# Altium schematic sheet Sheet1.SchDoc
size A4
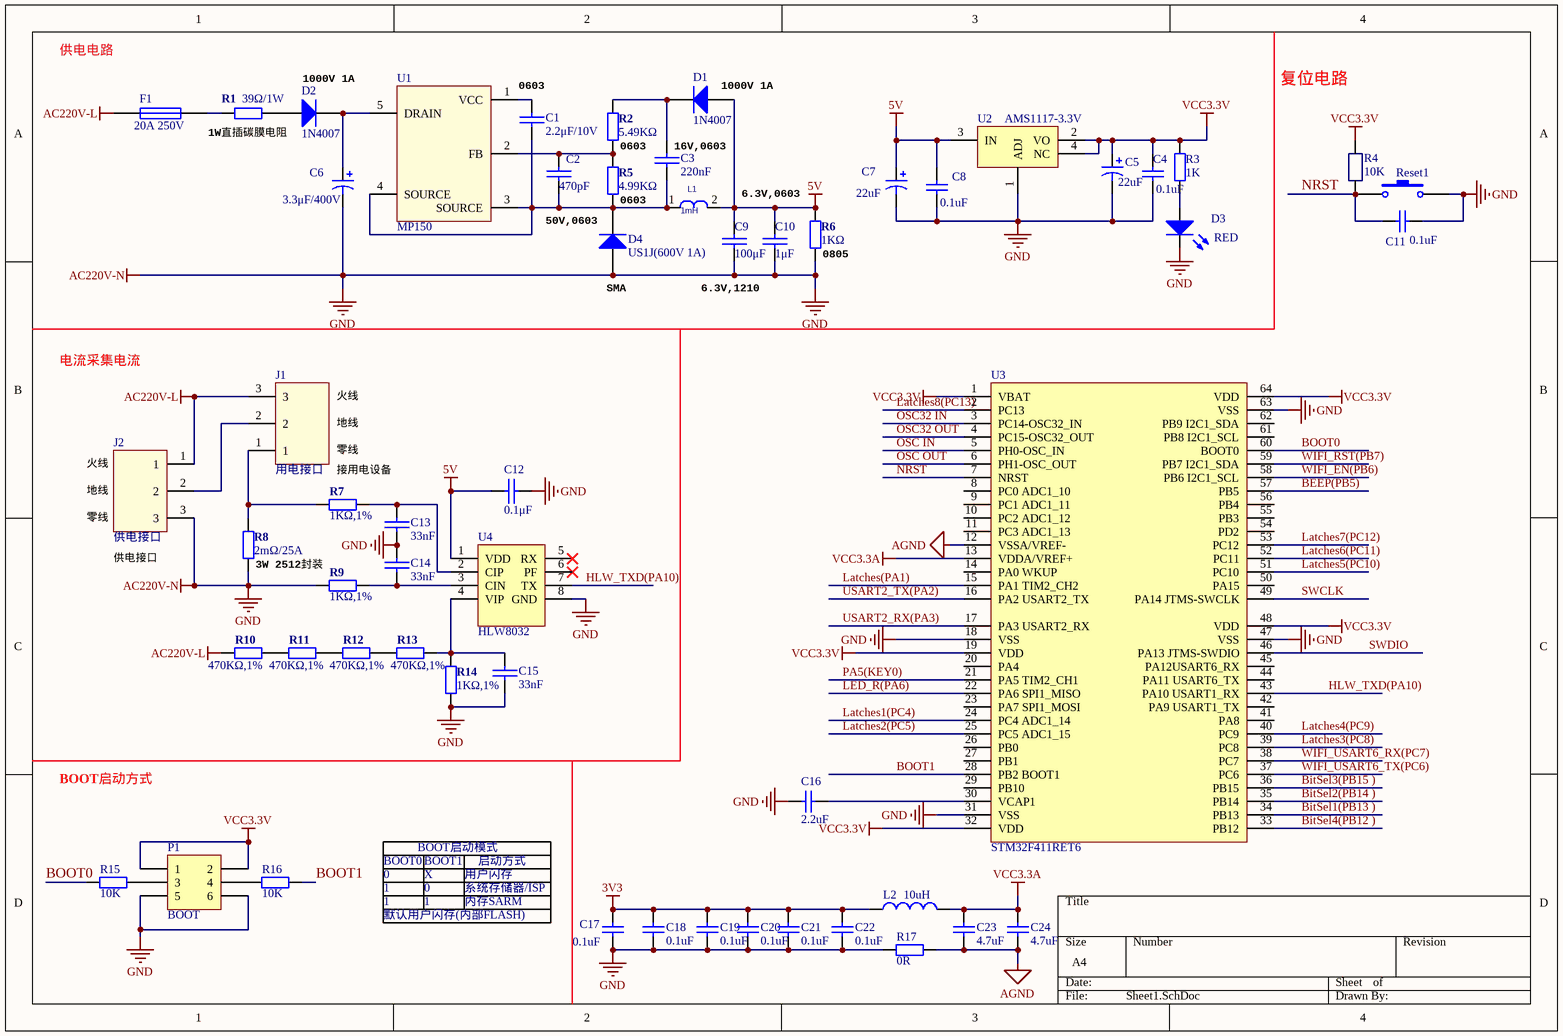
[diagram p0: Sheet1.SchDoc]

## Parts
C1  2.2μF/10V  [LC-0603_C(2.2UF/10V)]
C2  470pF  [LC-0603_C(普通电容)]
C3  220nF  [LC-0603_C(普通电容)]
C4  0.1uF  [LC-0603_C(普通电容)]
C5  22uF  [钽电容0603（25v）]
C6  3.3μF/400V  [直插电解电容 - duplicate]
C7  22uF  [钽电容0603（25v）]
C8  0.1uF  [LC-0603_C(普通电容)]
C9  100μF  [LC-1210_C大电容]
C10  1μF  [LC-0603_C(普通电容)]
C11  0.1uF  [LC-0603_C(普通电容)]
C12  0.1μF  [LC-0603_C(普通电容)]
C13  33nF  [LC-0805_C]
C14  33nF  [LC-0805_C]
C15  33nF  [LC-0805_C]
C16  2.2uF  [LC-0603_C(普通电容)]
C17  0.1uF  [LC-0603_C(普通电容)]
C18  0.1uF  [LC-0603_C(普通电容)]
C19  0.1uF  [LC-0603_C(普通电容)]
C20  0.1uF  [LC-0603_C(普通电容)]
C21  0.1uF  [LC-0603_C(普通电容)]
C22  0.1uF  [LC-0603_C(普通电容)]
C23  4.7uF  [LC-0603_C(普通电容)]
C24  4.7uF  [LC-0603_C(普通电容)]
D1  1N4007  [1N4007]
D2  1N4007  [1N4007]
D3  RED  [LED0603]
D4  US1J(600V 1A)  [US1J二极管LC-SMA(DO-214AC)_S1]
F1  20A 250V  [FUSE_BASE]
J1  用电接口  [3.81-3P(接线端子)输出]
J2  供电接口  [3.81-3P(接线端子)输入]
L1  1mH  [L-10X14(电感)]
L2  10uH  [电感(L0603)]
P1  BOOT  [Header2*3 2.54mm]
R1  39Ω/1W  [炭膜电阻]
R2  5.49KΩ  [LC-0603_R(电阻)]
R3  value 1K  [LC-0603_R(电阻)]  (hidden comment: 10k)
R4  10K  [LC-0603_R(电阻)]
R5  4.99KΩ  [LC-0603_R(电阻)]
R6  1KΩ  [LC-0805_R]
R7  1KΩ,1%  [LC-0805_R]
R8  2mΩ/25A  [R2512猛铜电阻]
R9  1KΩ,1%  [LC-0805_R]
R10  470KΩ,1%  [LC-0805_R]
R11  470KΩ,1%  [LC-0805_R]
R12  470KΩ,1%  [LC-0805_R]
R13  470KΩ,1%  [LC-0805_R]
R14  1KΩ,1%  [LC-0805_R]
R15  10k  [LC-0603_R(电阻)]
R16  10k  [LC-0603_R(电阻)]
R17  value 0R  [LC-0603_R(电阻)]  (hidden comment: 10k)
Reset1  SW-PB  [key]  (value not drawn)
U1  MP150  [MP150(LC-SOT-23-5)]
U2  AMS1117-3.3V  [SOT-223(ASM117-3.3)]
U3  STM32F411RET6  [MCU-LQFP64]
U4  HLW8032  [(HLW8032)LC-SOP-8_150mil]

## Nets
3V3: C17.2 C18.2 C19.2 C20.1 C21.1 C22.1 L2.1
5V: C7.1 C8.2 C9.2 C10.2 C12.1 D1.1(A) L1.2 R6.2 U2.3(IN) U4.1(VDD)
AC220V-L: F1.2 J1.3 J2.1 R10.2
AC220V-N: C4.1 C5.2 C6.2 C7.2 C8.1 C9.1 C10.1 C11.1 C12.2 C13.2 C14.1 C15.2 C16.1 C17.1 C18.1 C19.1 C20.2 C21.2 C22.2 D3.2(K) D4.1(A) J2.3 P1.5 P1.6 R6.1 R8.2 R9.2 R14.2 R17.2 Reset1.2 U2.1(ADJ) U3.18(VSS) U3.31(VSS) U3.47(VSS) U3.63(VSS) U4.8(GND)  [also labelled GND]
AGND: C23.1 C24.1 R17.1 U3.12(VSSA/VREF-)
VCC3.3A: C23.2 C24.2 L2.2 U3.13(VDDA/VREF+)
VCC3.3V: C4.2 C5.1 P1.1 P1.2 R3.1 R4.2 U2.2(VO) U2.4(NC) U3.1(VBAT) U3.19(VDD) U3.32(VDD) U3.48(VDD) U3.64(VDD)
BEEP(PB5): U3.57(PB5)
BitSel1(PB13 ): U3.34(PB13)
BitSel2(PB14 ): U3.35(PB14)
BitSel3(PB15 ): U3.36(PB15)
BitSel4(PB12 ): U3.33(PB12)
BOOT0: R15.2 U3.60(BOOT0)
BOOT1: R16.1 U3.28(PB2_BOOT1)
HLW_TXD(PA10): U3.43(PA10_USART1_RX) U4.7(TX)
Latches1(PC4): U3.24(PC4_ADC1_14)
Latches2(PC5): U3.25(PC5_ADC1_15)
Latches3(PC8): U3.39(PC8)
Latches4(PC9): U3.40(PC9)
Latches5(PC10): U3.51(PC10)
Latches6(PC11): U3.52(PC11)
Latches7(PC12): U3.53(PC12)
Latches8(PC13): U3.2(PC13)
Latches(PA1): U3.15(PA1_TIM2_CH2)
LED_R(PA6): U3.22(PA6_SPI1_MISO)
NRST: C11.2 R4.1 Reset1.1 U3.7(NRST)
OSC32 IN: U3.3(PC14-OSC32_IN)
OSC32 OUT: U3.4(PC15-OSC32_OUT)
OSC IN: U3.5(PH0-OSC_IN)
OSC OUT: U3.6(PH1-OSC_OUT)
PA5(KEY0): U3.21(PA5_TIM2_CH1)
SWCLK: U3.49(PA14_JTMS-SWCLK)
SWDIO: U3.46(PA13_JTMS-SWDIO)
USART2_RX(PA3): U3.17(PA3_USART2_RX)
USART2_TX(PA2): U3.16(PA2_USART2_TX)
WIFI_EN(PB6): U3.58(PB6_I2C1_SCL)
WIFI_RST(PB7): U3.59(PB7_I2C1_SDA)
WIFI_USART6_RX(PC7): U3.38(PC7)
WIFI_USART6_TX(PC6): U3.37(PC6)
NetC1_1: C1.1 C2.1 C3.1 D4.2(K) L1.1 R5.1 U1.3(SOURCE) U1.4(SOURCE)
NetC1_2: C1.2 U1.1(VCC)
NetC2_2: C2.2 R2.1 R5.2 U1.2(FB)
NetC3_2: C3.2 D1.2(K) R2.2
NetC6_1: C6.1 D2.2(K) U1.5(DRAIN)
NetC13_1: C13.1 R7.1 U4.2(CIP)
NetC14_2: C14.2 R9.1 U4.3(CIN)
NetC15_1: C15.1 R13.1 R14.1 U4.4(VIP)
NetC16_2: C16.2 U3.30(VCAP1)
NetD2_1: D2.1(A) R1.2
NetD3_1: D3.1(A) R3.2
NetF1_1: F1.1 R1.1
NetJ1_1: J1.1 R7.2 R8.1
NetJ1_2: J1.2 J2.2
NetP1_3: P1.3 R15.1
NetP1_4: P1.4 R16.2
NetR10_1: R10.1 R11.2
NetR11_1: R11.1 R12.2
NetR12_1: R12.1 R13.2

Not connected (* = marked no-connect by the designer): U3 8(PC0_ADC1_10) 9(PC1_ADC1_11) 10(PC2_ADC1_12) 11(PC3_ADC1_13) 14(PA0_WKUP) 20(PA4) 23(PA7_SPI1_MOSI) 26(PB0) 27(PB1) 29(PB10) 41(PA8) 42(PA9_USART1_TX) 44(PA11_USART6_TX) 45(PA12USART6_RX) 50(PA15) 54(PD2) 55(PB3) 56(PB4) 61(PB8_I2C1_SCL) 62(PB9_I2C1_SDA); U4 5(RX)* 6(PF)*

## Notes on the sheet
- 供电电路
- (near D2) 1000V 1A
- 0603
- (near D1) 1000V 1A
- 复位电路
- (near R1) 1W直插碳膜电阻
- (near R2) 0603
- (near C3) 16V,0603
- 50V,0603
- (near R5) 0603
- 6.3V,0603
- (near D4) SMA
- 6.3V,1210
- (near R6) 0805
- 电流采集电流
- 火线
- 地线
- 零线
- (near R7) 接用电设备
- (near J2) 供电接口
- (near R8) 3W 2512封装
- BOOT启动方式
- BOOT启动模式
- BOOT0
- 0
- 1
- 默认用户闪存(内部FLASH)
- BOOT1
- X
- 用户闪存
- 系统存储器/ISP
- 内存SARM
- 启动方式

## Library data of the parts
C1 = CAP: 贴片电容; Value: 100nF (104) ±10% 50V; 封装: 0603; 规格: 2.2uF(2252.2uF(225) ±10% 16V 编带; 立创商城编号: C43922; 名称: 贴片电容
C2 C3 C9 C10 C12-C15 = CAP: 贴片电容; Value: 100nF (104) ±10% 50V
  C2 C3: 立创商城编号: 常用
  C9 C12: 立创商城编号: C49066
  C10: 立创商城编号: C14664
  C13-C15: 立创商城编号: C86036
C4 C17-C22 = CAP: 贴片电容; 封装: 0402; 规格: ±10% 25V; 名称: 贴片电容; 值: 0.1UF
C5 = Cap Pol2: 钽电容; 名称: 钽电容(基美); 封装: CASE-D_7343; 规格: ±10% 25V 编带; 值: 22UF; 立创商城编号: C122303
C6 = Cap Pol1: 直插电解电容; 名称: 电解电容; 规格: 3.3uF 400V 袋装 6.3*12; 立创商城编号: C47905
C7 = Cap Pol2: 钽电容、; 名称: 钽电容(基美); 封装: CASE-D_7343; 规格: ±10% 25V 编带; 值: 22uf; 立创商城编号: C122249
C8 C16 = CAP: 贴片电容; 封装: 0603; 规格: ±10% 25V; 名称: 贴片电容
  C8: 值: 0.1UF
  C16: 值: 2.2UF
C11 = Cap Semi: 贴片电容; Published: 8-Jun-2000; LatestRevisionDate: 29-May-2009; LatestRevisionNote: IPC-7351 Footprint Added.; PackageReference: C1206; Publisher: Altium Limited; PackageDescription: Chip Capacitor; Value: 0.1uF
C23 C24 = CAP: 贴片电容; 封装: 0402; 规格: ±10% 25V; 值: 1UF; 名称: 贴片电容
D1 = Diode 1N5408: 贴片二极管; 名称: 1N4007(SK); 规格: M7 编带; 封装: SMA(DO-214AC)-S1; 立创商城编号: C126233
D2 = Diode 1N5408: 贴片二极管; 名称: 贴片二极管（SK）; 封装: SMA(DO-214AC)-S1; 规格: M7 编带; 立创商城编号: 常用
D3 = LED1: 发光二极管0603; 名称: LED灯; 封装: 0603; 规格: RED
D4 = Diode 1N5408: 贴片二极管; Published: 8-Jun-2000; LatestRevisionDate: 17-Jul-2002; LatestRevisionNote: Re-released for DXP Platform.; DatasheetDocument: Aug-1984; PackageReference: DO-201AD; Publisher: Altium Limited; ComponentLink1Description: Manufacturer Link; ComponentLink1URL: http://www.irf.com/; 立创商城编号: C86560
F1 = Fuse 1: Fuse; 名称: 保险丝夹/座; 规格: 20A，250V，黄铜镀锡(镀镍); 立创商城编号: C3130（座）C13567(保险丝)
J1 J2 = Port-3P: 直插接线端子; 立创商城编号: C36780
L1 = IND_8: 直插绕线电感; CISPartType: Inductor\Ferrite; OriginalSymbolOrigin: (0,0); ATHEROS KEY: 078-100LM-000; AtherosDescription: IND,SMT,SHIELDING CHOKE,10uH,7.3x7.3; 立创商城编号: C72626
L2 = Inductor: 名称: 电感; 值: 4.7UH; 封装: 0603
P1 = Header 3X2: Header, 3-Pin, 杜邦线2.54; LatestRevisionDate: 17-Jul-2002; LatestRevisionNote: Re-released for DXP Platform.; Publisher: Altium Limited
R1 R6 R7 R9 R14 = 电阻: 贴片电阻; 名称: 电阻
  R1: 封装: 39Ω/1W; 立创商城编号: C65614
  R6 R7 R9 R14: 型号: 1KΩ; 立创商城编号: C17513
R2 R5 R8 R10-R13 = 电阻: 贴片电阻; 型号: 1KΩ; 名称: 电阻
  R2: 立创商城编号: C23069
  R5: 立创商城编号: C23046
  R10-R13: 立创商城编号: C17709
R3 R15-R17 = Res2: 贴片电阻; Published: 8-Jun-2000; LatestRevisionDate: 17-Jul-2002; LatestRevisionNote: Re-released for DXP Platform.; PackageReference: AXIAL-0.4; Publisher: Altium Limited; PackageDescription: Axial Device, Thru-Hole; 2 Leads; 0.4 in Pin Spacing
  R15 R16: Value: 10K
R4 = RES: 贴片电阻
Reset1 = SW-PB: 轻触开关 3*6*2.5mm 白头; Published: 24-Mar-1999; LatestRevisionDate: 17-Jul-2002; LatestRevisionNote: Re-released for DXP Platform.; PackageReference: SPST-2; Publisher: Altium Limited; PackageDescription: Switch; 2 Leads
U1 = MP150: IC; 封装: SOT-23-5; 规格: MP150GJ-Z 编带; 名称: MP150; 立创商城编号: C55199
U2 = AMS1117-3.3V: 稳压芯片转3V3; 名称: 低压差线性稳压(LDO); 规格: AMS1117-3.3 编带; 封装: SOT-223; 立创商城编号: C6186
U3 = STM32F411: MCU; 封装: STM-LQFP64_M; 名称: STM32F411RET6
U4 = HLW8032: 电量计芯片